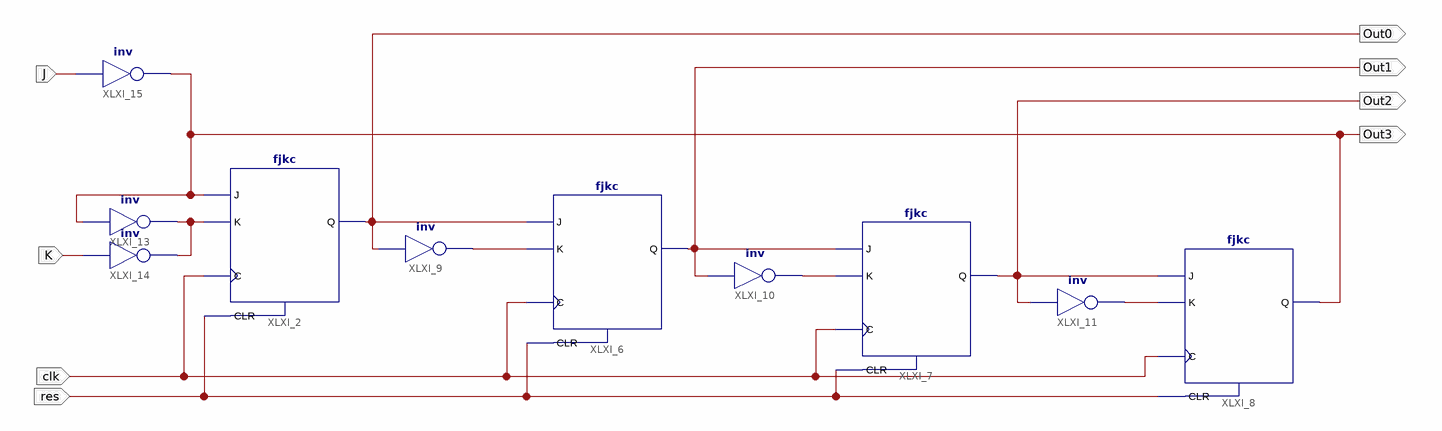
[diagram p0: schematic sheet 1]
// Xilinx ISE schematic broq42.sch (spartan3e) as structural Verilog: 10 symbols, 8 ports
module broq42 (
  input  res,
  input  clk,
  input  K,
  input  J,
  output Out0,
  output Out1,
  output Out2,
  output Out3
);

  wire XLXN_2, XLXN_4, XLXN_6, XLXN_26;

  fjkc XLXI_2 (.C(clk), .CLR(res), .J(Out3), .K(XLXN_26), .Q(Out0));
  fjkc XLXI_6 (.C(clk), .CLR(res), .J(Out0), .K(XLXN_2), .Q(Out1));
  fjkc XLXI_7 (.C(clk), .CLR(res), .J(Out1), .K(XLXN_4), .Q(Out2));
  fjkc XLXI_8 (.C(clk), .CLR(res), .J(Out2), .K(XLXN_6), .Q(Out3));
  not XLXI_9 (XLXN_2, Out0);
  not XLXI_10 (XLXN_4, Out1);
  not XLXI_11 (XLXN_6, Out2);
  not XLXI_13 (XLXN_26, Out3);
  not XLXI_14 (XLXN_26, K);
  not XLXI_15 (Out3, J);
endmodule
